# Altium schematic sheet DnDBopIt.SchDoc
size A; Revision: 5000; SheetNumber: 1; SheetTotal: 1
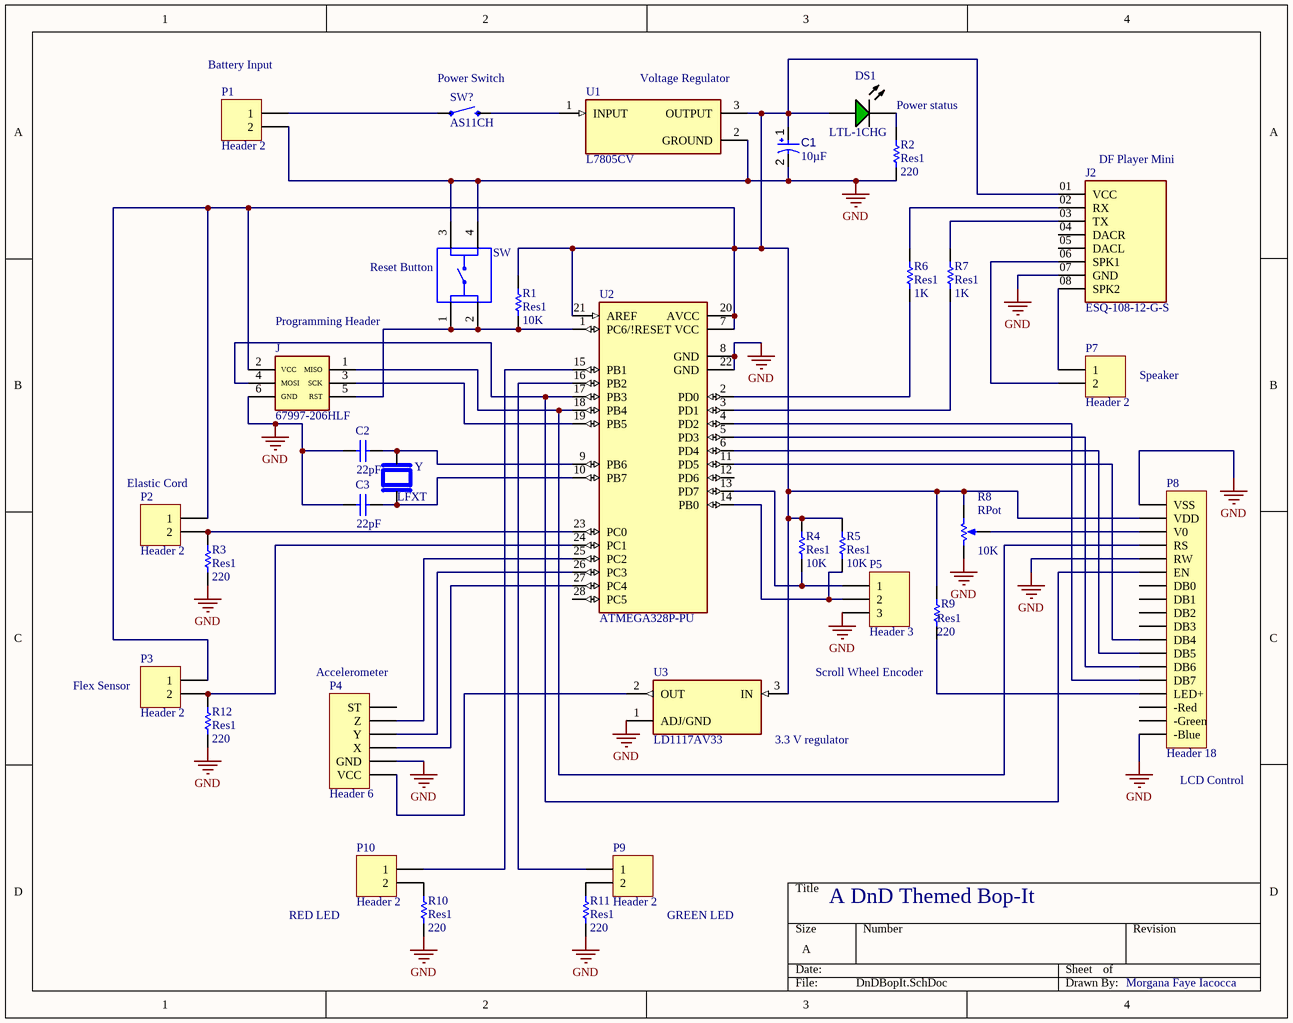
[diagram p0: DnDBopIt.SchDoc]

## Parts
C1  value 10µF  [CAPPR55-200-1100X500X1200]  (hidden comment: ECA1HM100)
C2  value 22pF  [RAD-0.3]
C3  value 22pF  [RAD-0.3]
DS1  LTL-1CHG  [LTST-LTL-1CHG-2]
J  67997-206HLF  [FRAMATOME_67997-206HLF]
J2  ESQ-108-12-G-S  [SAMTEC_ESQ-108-12-G-S]
P1  Header 2  [HDR1X2]
P2  Header 2  [HDR1X2]
P3  Header 2  [HDR1X2]
P4  Header 6  [HDR1X6]
P5  Header 3  [HDR1X3]
P7  Header 2  [HDR1X2]
P8  Header 18  [HDR1X18]
P9  Header 2  [HDR1X2]
P10  Header 2  [HDR1X2]
R1  Res1  value 10K  [AXIAL-0.3]
R2  Res1  value 220  [AXIAL-0.3]
R3  Res1  value 220  [AXIAL-0.3]
R4  Res1  value 10K  [AXIAL-0.3]
R5  Res1  value 10K  [AXIAL-0.3]
R6  Res1  value 1K  [AXIAL-0.3]
R7  Res1  value 1K  [AXIAL-0.3]
R8  RPot  value 10K  [VR5]
R9  Res1  value 220  [AXIAL-0.3]
R10  Res1  value 220  [AXIAL-0.3]
R11  Res1  value 220  [AXIAL-0.3]
R12  Res1  value 220  [AXIAL-0.3]
SW  (no value)  [SW_1825910-6-4]
SW?  AS11CH  [AS11CH]
U1  L7805CV  [TO255P1040X460X1968-3]
U2  ATMEGA328P-PU  [DIP794W46P254L2967H457Q28B]
U3  LD1117AV33  [TO255P1020X450X1968-3]
Y  LFXT  [HC49P488W45L1105T470H410]

## Nets
GND: C1.2 C2.1 C3.1 J.6(GND) J2.07(GND) P1.2 P4.5(GND) P5.3 P8.1(VSS) P8.5(RW) P8.18(-Blue) R2.2 R3.2 R8.2(BOT) R10.1 R11.1 R12.1 SW.3 SW.4 U1.2(GROUND) U2.8(GND) U2.22(GND) U3.1(ADJ/GND)
NetC1_1: C1.1 DS1.1(A) J.2(VCC) J2.01(VCC) P2.1 P3.1 P8.2(VDD) R1.2 R4.2 R5.2 R8.1(TOP) R9.2 U1.3(OUTPUT) U2.7(VCC) U2.20(AVCC) U2.21(AREF) U3.3(IN)
NetC2_2: C2.2 U2.9(PB6) Y.1
NetC3_2: C3.2 U2.10(PB7) Y.2
NetDS1_2: DS1.2(K) R2.1
NetJ2_02: J2.02(RX) R6.2
NetJ2_03: J2.03(TX) R7.2
NetJ2_06: J2.06(SPK1) P7.2
NetJ2_08: J2.08(SPK2) P7.1
NetJ_1: J.1(MISO) P8.4(RS) U2.18(PB4)
NetJ_3: J.3(SCK) U2.19(PB5)
NetJ_4: J.4(MOSI) P8.6(EN) U2.17(PB3)
NetJ_5: J.5(RST) R1.1 SW.1 SW.2 U2.1(PC6/!RESET)
NetP1_1: P1.1 SW?.1
NetP2_2: P2.2 R3.1 U2.23(PC0)
NetP3_2: P3.2 R12.2 U2.24(PC1)
NetP4_2: P4.2(Z) U2.25(PC2)
NetP4_3: P4.3(Y) U2.26(PC3)
NetP4_4: P4.4(X) U2.27(PC4)
NetP4_6: P4.6(VCC) U3.2(OUT)
NetP5_1: P5.1 R4.1 U2.13(PD7)
NetP5_2: P5.2 R5.1 U2.14(PB0)
NetP8_3: P8.3(V0) R8.3(TAP)
NetP8_11: P8.11(DB4) U2.11(PD5)
NetP8_12: P8.12(DB5) U2.6(PD4)
NetP8_13: P8.13(DB6) U2.5(PD3)
NetP8_14: P8.14(DB7) U2.4(PD2)
NetP8_15: P8.15(LED+) R9.1
NetP9_1: P9.1 U2.16(PB2)
NetP9_2: P9.2 R11.2
NetP10_1: P10.1 U2.15(PB1)
NetP10_2: P10.2 R10.2
NetR6_1: R6.1 U2.2(PD0)
NetR7_1: R7.1 U2.3(PD1)
NetSW?_3: SW?.3 U1.1(INPUT)

Not connected (* = marked no-connect by the designer): J2 04(DACR) 05(DACL); P4 1(ST); P8 7(DB0) 8(DB1) 9(DB2) 10(DB3) 16(-Red) 17(-Green); U2 12(PD6) 28(PC5)

## Notes on the sheet
- (near P1) Battery Input
- (near SW?) Power Switch
- (near U1) Voltage Regulator
- Power status
- (near J2) DF Player Mini
- (near SW) Reset Button
- (near J) Programming Header
- Speaker
- (near P2) Elastic Cord
- (near P3) Flex Sensor
- (near P4) Accelerometer
- Scroll Wheel Encoder
- (near U3) 3.3 V regulator
- (near P8) LCD Control
- A DnD Themed Bop-It
- RED LED
- GREEN LED
- Morgana Faye Iacocca

## Library data of the parts
C1 = CMP-001-00025-5: Aluminum Electrolytic Capacitor, 10 uF, +/- 20%, 50 V, -40 to 85 degC, 2-Pin THD, RoHS, Bulk; Manufacturer: Panasonic; Ripple Current (AC): 65mA; Voltage Rating: 50V; Min Operating Temperature: -40°C; RoHS Compliant: True; Packaging: Bulk; Pins: 2; Case/Package: Radial; Datasheet URL: https://industrial.panasonic.com/cdbs/www-data/pdf/RDF0000/ABA0000C1218.pdf; Tolerance: 20%; Ripple Current: 65mA; Capacitor Type: Electrolytic; Lead Pitch: 2mm; Max Operating Temperature: 85°C; Package Description: 2-Pin Radial Lead, Dia 5 mm, Height 12 mm; Mounting Technology: TH; Diameter: 5mm; Package Reference: CAPPR55-200-1100X500X1200; Datasheet Version: Rev. 05, 10/2016; Manufacturer URL: http://www.panasonic.com/; Package Quantity: 200
C2 C3 = Cap: Capacitor; Published: 8-Jun-2000; LatestRevisionDate: 17-Jul-2002; LatestRevisionNote: Re-released for DXP Platform.; PackageReference: RAD-0.3; Publisher: Altium Limited; PackageDescription: Radial Cap, Thru-Hole; 2 Leads; 0.3 in Pin Spacing
DS1 = CMP-007-00019-1: LED Uni-Color Green, 100 mW, 30 mA, -55 to 100 degC, 2-Pin THD, RoHS, Bulk; Manufacturer: Lite-On; Lens Style: Dome; Forward Voltage: 2.6V; Luminous Intensity: 12.6mcd; Forward Current: 30mA; Power: 100mW; Viewing Angle: 60degrees; Nominal Vf: 2.1V; Pins: 2; Mounting Technology: TH; Datasheet URL: http://datasheet.octopart.com/LTL-1CHG-Lite-On-datasheet-143841.pdf; Package Quantity: 1000; Colour: Green; Datasheet Version: Mar-00; Max Operating Temperature: 100°C; Package Description: 2-Pin Through Hole Device, Dia 3.8 mm; Packaging: Bulk; Min Operating Temperature: -55°C; RoHS Compliant: True; Case/Package: Radial; Package Reference: LTL-1CHG; Illumination Colour: Green; Manufacturer URL: http://www.us.liteon.com/
J = 67997-206HLF: Connector Header Through Hole 6 position 0.100 _2.54mm_; MF: Amphenol ICC; SnapEDA_Link: https://www.snapeda.com/parts/67997-206HLF/Amphenol%20FCI/view-part/103429/?ref=snap; Value: *; Digi-Key_Purchase_URL: https://www.digikey.com/product-detail/en/amphenol-icc-fci/67997-206HLF/609-3234-ND/1878491?utm_source=snapeda&utm_medium=aggregator&utm_campaign=symbol; Digi-Key_Part_Number: 609-3234-ND; MP: 67997-206HLF; Package: None
P1-P3 P7 P9 P10 = Header 2: Header, 2-Pin; LatestRevisionDate: 17-Jul-2002; LatestRevisionNote: Re-released for DXP Platform.; Publisher: Altium Limited
P4 = Header 6: Header, 6-Pin; LatestRevisionDate: 17-Jul-2002; LatestRevisionNote: Re-released for DXP Platform.; Publisher: Altium Limited
P5 = Header 3: Header, 3-Pin; LatestRevisionDate: 17-Jul-2002; LatestRevisionNote: Re-released for DXP Platform.; Publisher: Altium Limited
P8 = Header 18: Header, 18-Pin; LatestRevisionDate: 17-Jul-2002; LatestRevisionNote: Re-released for DXP Platform.; Publisher: Altium Limited
R1-R7 R9-R12 = Res1: Resistor; Published: 8-Jun-2000; LatestRevisionDate: 17-Jul-2002; LatestRevisionNote: Re-released for DXP Platform.; PackageReference: AXIAL-0.3; Publisher: Altium Limited; PackageDescription: Axial Device, Thru-Hole; 2 Leads; 0.3 in Pin Spacing
R8 = RPot: Potentiometer; Sim Note: Enter the Resistance value and the set point into parameter fields.; Set Position: 0.5; Published: 8-Jun-2000; LatestRevisionDate: 17-Jul-2002; LatestRevisionNote: Re-released for DXP Platform.; PackageReference: VR5; Publisher: Altium Limited; PackageDescription: Variable Resistor, Thru-Hole; 3 Leads
SW = 1825910-6: Switch Push Button OFF _ON_ SPST Round Button 0.05A 24VDC Momentary Contact PC Pins Thru-Hole; Configuration_Pole-Throw: Single Pole - Single Throw; MF: TE Connectivity; Contact_Current_Rating: 50 mA; Digi-Key_Purchase_URL: https://www.digikey.com/product-detail/en/te-connectivity-alcoswitch-switches/1825910-6/450-1650-ND/1632536?utm_source=snapeda&utm_medium=aggregator&utm_campaign=symbol; TE_purchase_URL: https://www.te.com/usa-en/product-1825910-6.html?te_bu=Cor&te_type=disp&te_campaign=seda_glo_cor-seda-global-disp-prtnr-fy19-seda-model-bom-cta_sma-317_1&elqCampaignId=32493; Value: *; Digi-Key_Part_Number: 450-1650-ND; SnapEDA_Link: https://www.snapeda.com/parts/1825910-6/TE%20Connectivity%20ALCOSWITCH%20Switches/view-part/424522/?ref=snap; EU_RoHS_Compliance: Compliant; MP: 1825910-6; Package: None
SW? = AS11CH: Slide Switch SPST Through Hole, Right Angle; MF: NKK Switches; MP: AS11CH; SnapEDA_Link: https://www.snapeda.com/parts/AS11CH/NKK%20Switches/view-part/343697/?ref=snap; Price: None; Check_prices: https://www.snapeda.com/parts/AS11CH/NKK%20Switches/view-part/343697/?ref=eda; Availability: Warning; Package: None; Purchase-URL: https://pricing.snapeda.com/search/part/AS11CH/?ref=eda; Value: *
U1 = L7805CV: Linear Voltage Regulator IC 1 Output 1.5A TO-220AB; MF: STMicroelectronics; Price: None; Package: TO-220 STMicroelectronics; Value: *; MP: L7805CV; Availability: Unavailable; SnapEDA_Link: https://www.snapeda.com/parts/L7805CV/STMicroelectronics/view-part/501150/?ref=snap
U2 = ATMEGA328P-PU: AVR AVRÂ® ATmega Microcontroller IC 8-Bit 20MHz 32KB _16K x 16_ FLASH 28-PDIP; MF: Microchip; Package: PDIP-28 Atmel; Value: *; Availability: Unavailable; SnapEDA_Link: https://www.snapeda.com/parts/ATMEGA328P-PU/Microchip/view-part/44282/?ref=snap; Price: None; MP: ATMEGA328P-PU
U3 = LD1117AV33: Linear Voltage Regulator IC 1 Output 1A TO-220AB; MF: STMicroelectronics; MP: LD1117AV33; SnapEDA_Link: https://www.snapeda.com/parts/LD1117AV33/STMicroelectronics/view-part/486946/?ref=snap; Value: *; Package: TO-220 STMicroelectronics; Price: None; Availability: Unavailable
Y = LFXTAL003240BULK: 16MHz Â±30ppm Crystal 30pF 40 Ohms HC-49/US; MF: IQD Frequency Products; MP: LFXTAL003240BULK; Price: None; SnapEDA_Link: https://www.snapeda.com/parts/LFXTAL003240BULK/IQD%20Frequency%20Products/view-part/2463585/?ref=snap; Availability: Unavailable; Value: *; Package: HC-49/US IQD Frequency Products
J2 = ESQ-108-12-G-S: Price: None; MP: ESQ-108-12-G-S; Availability: Unavailable; Package: None; Value: *